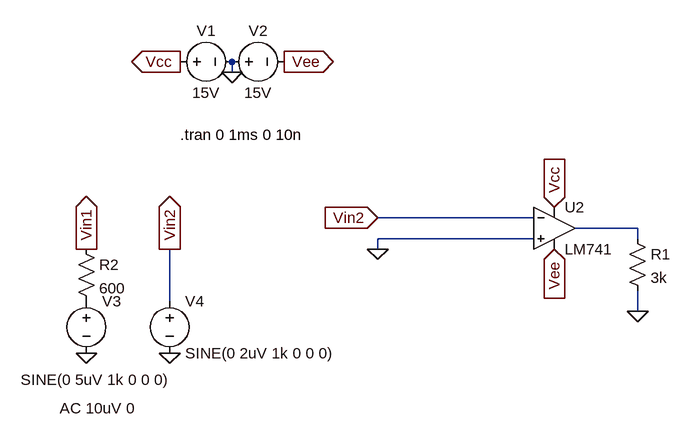
[diagram p0: schematic open_loop_gain.asc]
open_loop_gain.asc, the LTspice schematic file:
Version 4.1
SHEET 1 880 680
WIRE -288 -96 -288 -112
WIRE 176 128 -64 128
WIRE 336 144 240 144
WIRE 176 160 -64 160
WIRE 336 160 336 144
WIRE -64 176 -64 160
WIRE -384 256 -384 176
WIRE 336 272 336 240
FLAG -288 -96 0
FLAG -368 -112 Vcc
IOPIN -368 -112 Out
FLAG -208 -112 Vee
IOPIN -208 -112 Out
FLAG 208 112 Vcc
IOPIN 208 112 In
FLAG 208 176 Vee
IOPIN 208 176 In
FLAG 336 272 0
FLAG -64 128 Vin2
IOPIN -64 128 In
FLAG -512 176 Vin1
IOPIN -512 176 Out
FLAG -384 176 Vin2
IOPIN -384 176 Out
FLAG -512 336 0
FLAG -384 336 0
FLAG -64 176 0
SYMBOL voltage -384 -112 R270
WINDOW 0 32 56 VTop 2
WINDOW 3 -32 56 VBottom 2
WINDOW 123 0 0 Left 0
WINDOW 39 0 0 Left 0
SYMATTR InstName V1
SYMATTR Value 15V
SYMBOL voltage -304 -112 R270
WINDOW 0 32 56 VTop 2
WINDOW 3 -32 56 VBottom 2
WINDOW 123 0 0 Left 0
WINDOW 39 0 0 Left 0
SYMATTR InstName V2
SYMATTR Value 15V
SYMBOL res 320 144 R0
SYMATTR InstName R1
SYMATTR Value 3k
SYMBOL voltage -512 240 R0
WINDOW 3 -101 137 Left 2
WINDOW 123 -41 181 Left 2
WINDOW 39 0 0 Left 0
SYMATTR Value SINE(0 5uV 1k 0 0 0)
SYMATTR Value2 AC 10uV 0
SYMATTR InstName V3
SYMBOL voltage -384 240 R0
WINDOW 123 24 124 Left 2
WINDOW 39 0 0 Left 0
SYMATTR InstName V4
SYMATTR Value SINE(0 2uV 1k 0 0 0)
SYMBOL LM741 208 80 R0
SYMATTR InstName U2
SYMBOL res -528 160 R0
SYMATTR InstName R2
SYMATTR Value 600
TEXT -368 0 Left 2 !.tran 0 1ms 0 10n

The netlist it stands for:
* open_loop_gain.asc
V1 Vcc 0 15V
V2 0 Vee 15V
R1 N001 0 3k
V3 P001 0 SINE(0 5uV 1k 0 0 0) AC 10uV 0
V4 Vin2 0 SINE(0 2uV 1k 0 0 0)
X§U2 0 Vin2 Vcc Vee N001 LM741  ; pins In+ In- V+ V- OUT
R2 Vin1 P001 600
.tran 0 1ms 0 10n
.lib LM741.lib
.backanno
.end

* Results of the author's LTspice run, read from the files saved beside the schematic
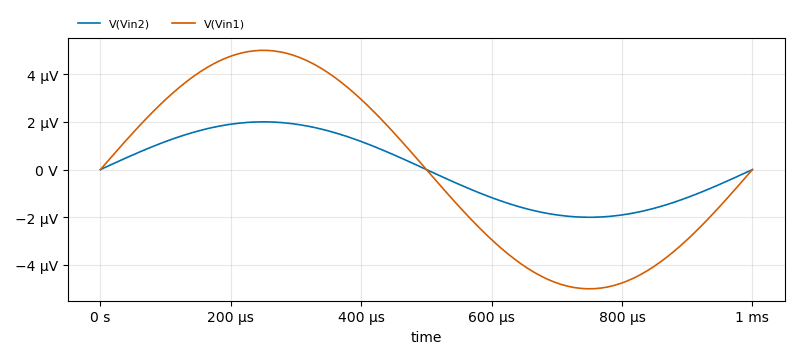
[diagram p1: Transient Analysis of open_loop_gain.asc, plotted from the saved traces]
* Transient Analysis, 1 run:
*   V(Vin2): min -2 µV, max 1.999 µV, average 0 V, rms 1.414 µV, last 0 V
*   V(Vin1): min -4.999 µV, max 4.998 µV, average 0 V, rms 3.536 µV, last 0 V